# EAGLE schematic p2x3p-001 (EAGLE 9.6.2)
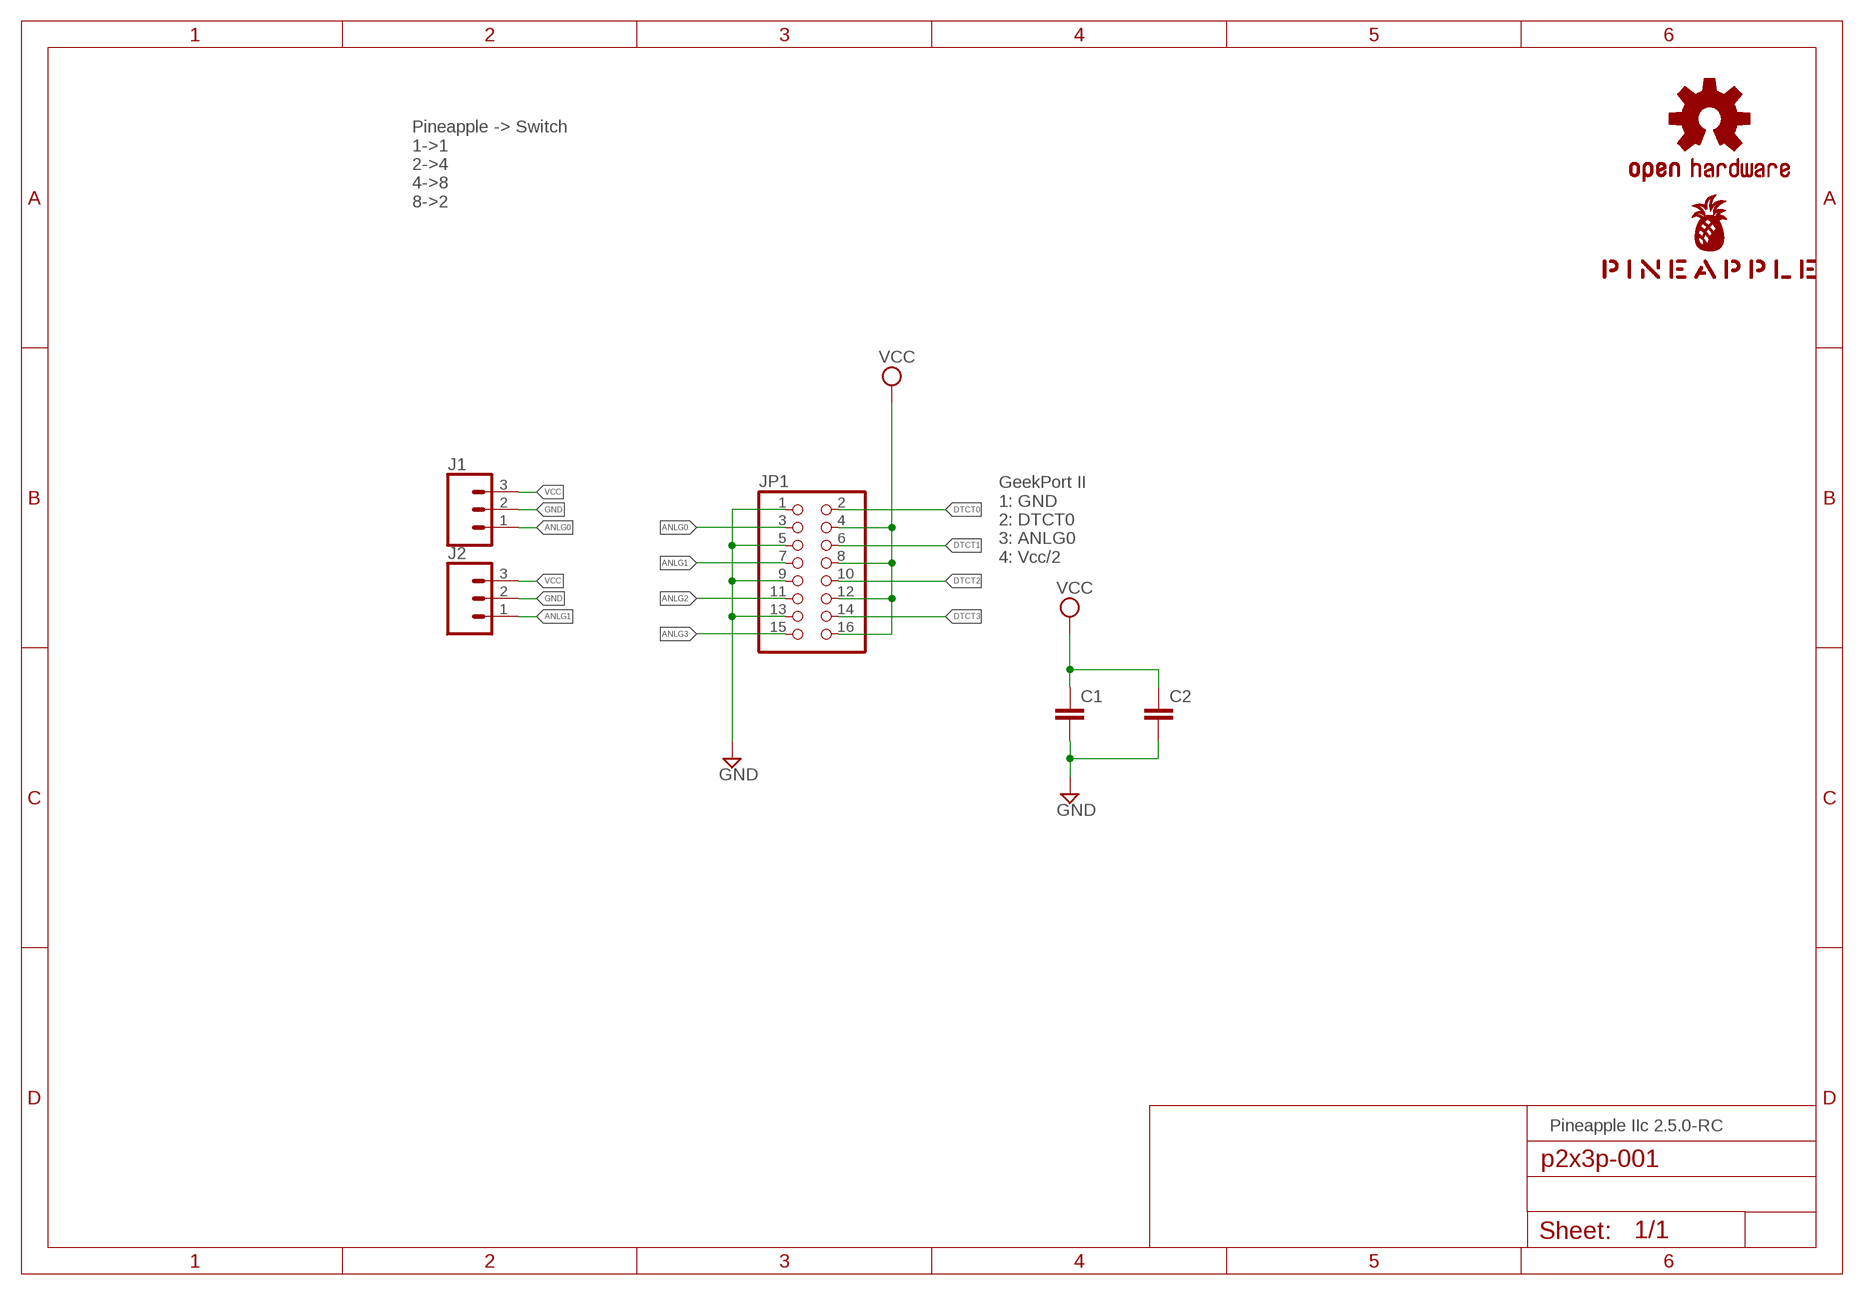
[diagram p0: schematic, sheet 1]

## Parts
C1  C-EU025-024X044  [C025-024X044]
C2  C-EU025-024X044  [C025-024X044]
J1  CONN_03JST-PTH  [JST-3-PTH]
J2  CONN_03JST-PTH  [JST-3-PTH]
JP1  PINHD-2X8  [2X08]
LOGO1  OSHW-LOGOS-COPPER  [OSHW-LOGO-S_COPPER]
U$1  PINEAPPLE450_SILK  [PINEAPPLE450_SILK]

## Nets
ANLG0: J1.1 JP1.3
ANLG1: J2.1 JP1.7
ANLG2: JP1.11
ANLG3: JP1.15
DTCT0: JP1.2
DTCT1: JP1.6
DTCT2: JP1.10
DTCT3: JP1.14
GND: C1.2 C2.2 J1.2 J2.2 JP1.1 JP1.5 JP1.9 JP1.13
VCC: C1.1 C2.1 J1.3 J2.3 JP1.4 JP1.8 JP1.12 JP1.16

## Notes on the sheet
- Pineapple -> Switch
  1->1
  2->4
  4->8
  8->2
- GeekPort II
  1: GND
  2: DTCT0
  3: ANLG0
  4: Vcc/2
- Pineapple IIc 2.5.0-RC

## Library data of the parts
C1 C2 = rcl:C-EU: CAPACITOR, European symbol; SPICEPREFIX: C
J1 J2 = SparkFun-Connectors:CONN_03: Multi connection point. Often used as Generic Header-pin footprint for 0.1 inch spaced/style header connections On any of the 0.1 inch spaced packages, you can populate with these: Break Away Headers - Straight <https://www.sparkfun.com/products/116> (PRT-00116) Break Away Male Headers - Right Angle <https://www.sparkfun.com/products/553> (PRT-00553) Female Headers <https://www.sparkfun.com/products/115> (PRT-00115) Break Away Headers - Machine Pin <https://www.sparkfun.com/products/117> (PRT-00117) Break Away Female Headers - Swiss Machine Pin <https://www.sparkfun.com/products/743> (PRT-00743) Stackable Header - 3 Pin (Female, 0.1") <https://www.sparkfun.com/products/13875> (PRT-13875) For SCREWTERMINALS and SPRING TERMINALS visit here: Screw Terimnals on SparkFun.com <https://www.sparkfun.com/search/results?term=Screw+Terminals> (5mm/3.5mm/2.54mm spacing) This device is also useful as a general connection point to wire up your design to another part of your project. Our various solder wires solder well into these plated through hole pads. Hook-Up Wire - Assortment (Stranded, 22 AWG) <https://www.sparkfun.com/products/11375> (PRT-11375) Hook-Up Wire - Assortment (Solid Core, 22 AWG) <https://www.sparkfun.com/products/11367> (PRT-11367) View the entire wire category on our website here <https://www.sparkfun.com/categories/141> Special notes: Molex polarized connector foot print use with SKU : PRT-08232 with associated crimp pins and housings.; PROD_ID: WIRE-10037; SF_ID: PRT-09915
JP1 = pinhead:PINHD-2X8: PIN HEADER
LOGO1 = SparkFun-Aesthetics:OSHW-LOGO: Open-Source Hardware (OSHW) Logo This logo indicates the piece of hardware it is found on incorporates a OSHW license and/or adheres to the definition of open source hardware found here: http://freedomdefined.org/OSHW
U$1 = pineapple:PINEAPPLE450_SILK

## Net classes
0 default: width 0.152 mm, drill 0.152 mm, clearance 0.152 mm
1 ground: width 0.305 mm, drill 0.152 mm, clearance 0.152 mm
2 power1: width 0.508 mm, drill 0.152 mm, clearance 0.152 mm
3 power2: width 0.61 mm, drill 0.152 mm, clearance 0.152 mm
4 analog: width 0.305 mm, drill 0.152 mm, clearance 0.152 mm
5 external: width 0.152 mm, drill 0.152 mm, clearance 0.152 mm